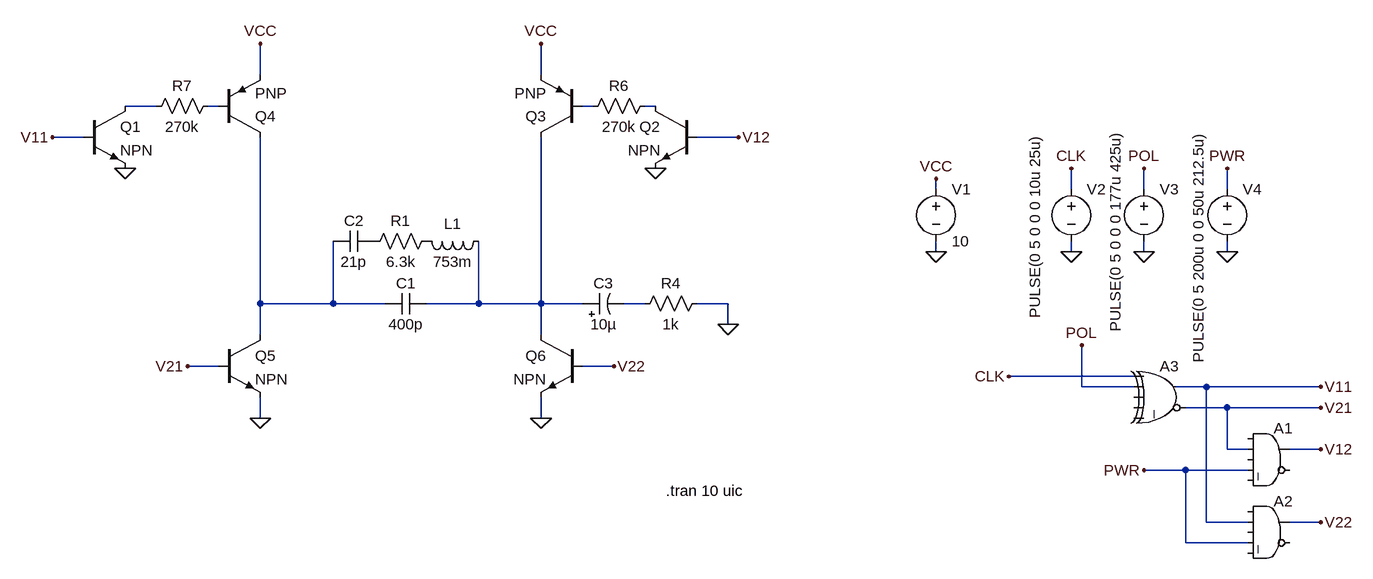
[diagram p0: schematic transducer_kontrol.asc]
transducer_kontrol.asc, the LTspice schematic file:
Version 4
SHEET 1 1712 680
WIRE -112 -128 -112 -176
WIRE 320 -128 320 -176
WIRE -272 -80 -320 -80
WIRE -176 -80 -192 -80
WIRE 400 -80 384 -80
WIRE 496 -80 480 -80
WIRE -384 -32 -432 -32
WIRE 624 -32 560 -32
WIRE 928 48 928 32
WIRE 1136 48 1136 16
WIRE 1248 48 1248 16
WIRE 1376 48 1376 16
WIRE 928 144 928 128
WIRE 1136 144 1136 128
WIRE 1248 144 1248 128
WIRE 1376 144 1376 128
WIRE -112 224 -112 -32
WIRE 0 224 0 128
WIRE 0 224 -112 224
WIRE 80 224 0 224
WIRE 224 224 224 128
WIRE 224 224 144 224
WIRE 320 224 320 -32
WIRE 320 224 224 224
WIRE 384 224 320 224
WIRE 480 224 448 224
WIRE 608 224 560 224
WIRE 608 256 608 224
WIRE -112 272 -112 224
WIRE 320 272 320 224
WIRE -176 320 -224 320
WIRE 432 320 384 320
WIRE 1232 336 1040 336
WIRE 1152 352 1152 288
WIRE 1232 352 1152 352
WIRE 1344 352 1296 352
WIRE 1520 352 1344 352
WIRE 1376 384 1312 384
WIRE 1520 384 1376 384
WIRE -112 400 -112 368
WIRE 320 400 320 368
WIRE 1376 448 1376 384
WIRE 1408 448 1376 448
WIRE 1520 448 1472 448
WIRE 1312 480 1248 480
WIRE 1408 480 1312 480
WIRE 1344 560 1344 352
WIRE 1408 560 1344 560
WIRE 1520 560 1472 560
WIRE 1312 592 1312 480
WIRE 1408 592 1312 592
FLAG -112 400 0
FLAG 320 400 0
FLAG -112 -176 VCC
FLAG 320 -176 VCC
FLAG 608 256 0
FLAG -432 -32 V11
FLAG 624 -32 V12
FLAG -224 320 V21
FLAG 432 320 V22
FLAG 928 144 0
FLAG 928 32 VCC
FLAG 496 16 0
FLAG -320 16 0
FLAG 1136 16 CLK
FLAG 1248 16 POL
FLAG 1248 144 0
FLAG 1136 144 0
FLAG 1040 336 CLK
FLAG 1152 288 POL
FLAG 1520 352 V11
FLAG 1520 560 V22
FLAG 1520 448 V12
FLAG 1520 384 V21
FLAG 1376 16 PWR
FLAG 1376 144 0
FLAG 1248 480 PWR
SYMBOL cap 144 208 R90
WINDOW 0 0 32 VBottom 2
WINDOW 3 32 32 VTop 2
SYMATTR InstName C1
SYMATTR Value 400p
SYMBOL cap 64 112 R90
WINDOW 0 0 32 VBottom 2
WINDOW 3 32 32 VTop 2
SYMATTR InstName C2
SYMATTR Value 21p
SYMBOL res 160 112 R90
WINDOW 0 0 56 VBottom 2
WINDOW 3 32 56 VTop 2
SYMATTR InstName R1
SYMATTR Value 6.3k
SYMBOL ind 240 112 R90
WINDOW 0 5 56 VBottom 2
WINDOW 3 32 56 VTop 2
SYMATTR InstName L1
SYMATTR Value 753m
SYMBOL npn -384 -80 R0
SYMATTR InstName Q1
SYMBOL npn 560 -80 M0
SYMATTR InstName Q2
SYMBOL pnp 384 -32 R180
SYMATTR InstName Q3
SYMBOL pnp -176 -32 M180
SYMATTR InstName Q4
SYMBOL npn -176 272 R0
SYMATTR InstName Q5
SYMBOL npn 384 272 M0
SYMATTR InstName Q6
SYMBOL polcap 384 240 R270
WINDOW 0 32 32 VTop 2
WINDOW 3 0 32 VBottom 2
SYMATTR InstName C3
SYMATTR Value 10µ
SYMBOL res 576 208 R90
WINDOW 0 0 56 VBottom 2
WINDOW 3 32 56 VTop 2
SYMATTR InstName R4
SYMATTR Value 1k
SYMBOL voltage 928 32 R0
WINDOW 123 0 0 Left 0
WINDOW 39 0 0 Left 0
SYMATTR InstName V1
SYMATTR Value 10
SYMBOL voltage 1136 32 R0
WINDOW 3 -56 -69 VRight 2
WINDOW 123 0 0 Left 0
WINDOW 39 0 0 Left 0
SYMATTR Value PULSE(0 5 0 0 0 10u 25u)
SYMATTR InstName V2
SYMBOL voltage 1248 32 R0
WINDOW 3 -44 -75 VRight 2
WINDOW 123 0 0 Left 0
WINDOW 39 0 0 Left 0
SYMATTR Value PULSE(0 5 0 0 0 177u 425u)
SYMATTR InstName V3
SYMBOL Digital\\xor 1280 304 R0
SYMATTR InstName A3
SYMBOL res 496 -96 R90
WINDOW 0 0 56 VBottom 2
WINDOW 3 32 56 VTop 2
SYMATTR InstName R6
SYMATTR Value 270k
SYMBOL res -176 -96 R90
WINDOW 0 0 56 VBottom 2
WINDOW 3 32 56 VTop 2
SYMATTR InstName R7
SYMATTR Value 270k
SYMBOL voltage 1376 32 R0
WINDOW 3 -44 -75 VRight 2
WINDOW 123 0 0 Left 0
WINDOW 39 0 0 Left 0
SYMATTR Value PULSE(0 5 200u 0 0 50u 212.5u)
SYMATTR InstName V4
SYMBOL Digital\\and 1440 400 R0
WINDOW 3 -14 112 Left 2
SYMATTR InstName A1
SYMBOL Digital\\and 1440 512 R0
WINDOW 3 -9 118 Left 2
SYMATTR InstName A2
TEXT 512 512 Left 2 !.tran 10 uic

The netlist it stands for:
* transducer_kontrol.asc
C1 N006 N005 400p
C2 P001 N005 21p
R1 P002 P001 6.3k
L1 N006 P002 753m
Q1 N001 V11 0 0 NPN
Q2 N004 V12 0 0 NPN
Q3 N006 N003 VCC 0 PNP
Q4 N005 N002 VCC 0 PNP
Q5 N005 V21 0 0 NPN
Q6 N006 V22 0 0 NPN
C3 N006 N007 10µ
R4 0 N007 1k
V1 VCC 0 10
V2 CLK 0 PULSE(0 5 0 0 0 10u 25u)
V3 POL 0 PULSE(0 5 0 0 0 177u 425u)
A3 CLK POL 0 0 0 V21 V11 0 XOR
R6 N004 N003 270k
R7 N002 N001 270k
V4 PWR 0 PULSE(0 5 200u 0 0 50u 212.5u)
A1 0 V21 0 PWR 0 0 V12 0 AND
A2 0 V11 0 PWR 0 0 V22 0 AND
.model NPN NPN
.model PNP PNP
.lib standard.bjt
.tran 10 uic
.backanno
.end